# Altium schematic sheet Serial Wire Debug.SchDoc
size A4
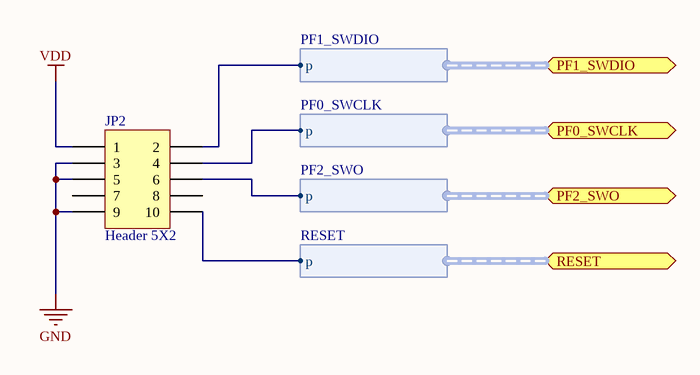
[diagram p0: Serial Wire Debug.SchDoc]

## Parts
JP2  Header 5X2  [HDR2X5]

## Ports
PF0_SWCLK (harness PF0_SWCLK), PF1_SWDIO (harness PF1_SWDIO), PF2_SWO (harness PF2_SWO), RESET (harness RESET)

## Harnesses
PF1_SWDIO: p
PF0_SWCLK: p
PF2_SWO: p
RESET: p

## Nets
GND: JP2.3 JP2.5 JP2.9
VDD: JP2.1
NetJP2_2: JP2.2 ; port PF1_SWDIO.p
NetJP2_4: JP2.4 ; port PF0_SWCLK.p
NetJP2_6: JP2.6 ; port PF2_SWO.p
NetJP2_10: JP2.10 ; port RESET.p

Not connected (* = marked no-connect by the designer): JP2 7 8

## Library data of the parts
JP2 = Header 5X2: Header, 5-Pin, Dual row; LatestRevisionDate: 17-Jul-2002; LatestRevisionNote: Re-released for DXP Platform.; Publisher: Altium Limited